# EAGLE schematic nucleum_logger (EAGLE 6.6.0)
AUTHOR: Joshua Adkins; REV: REV_A; TITLE: Nucleum Logger
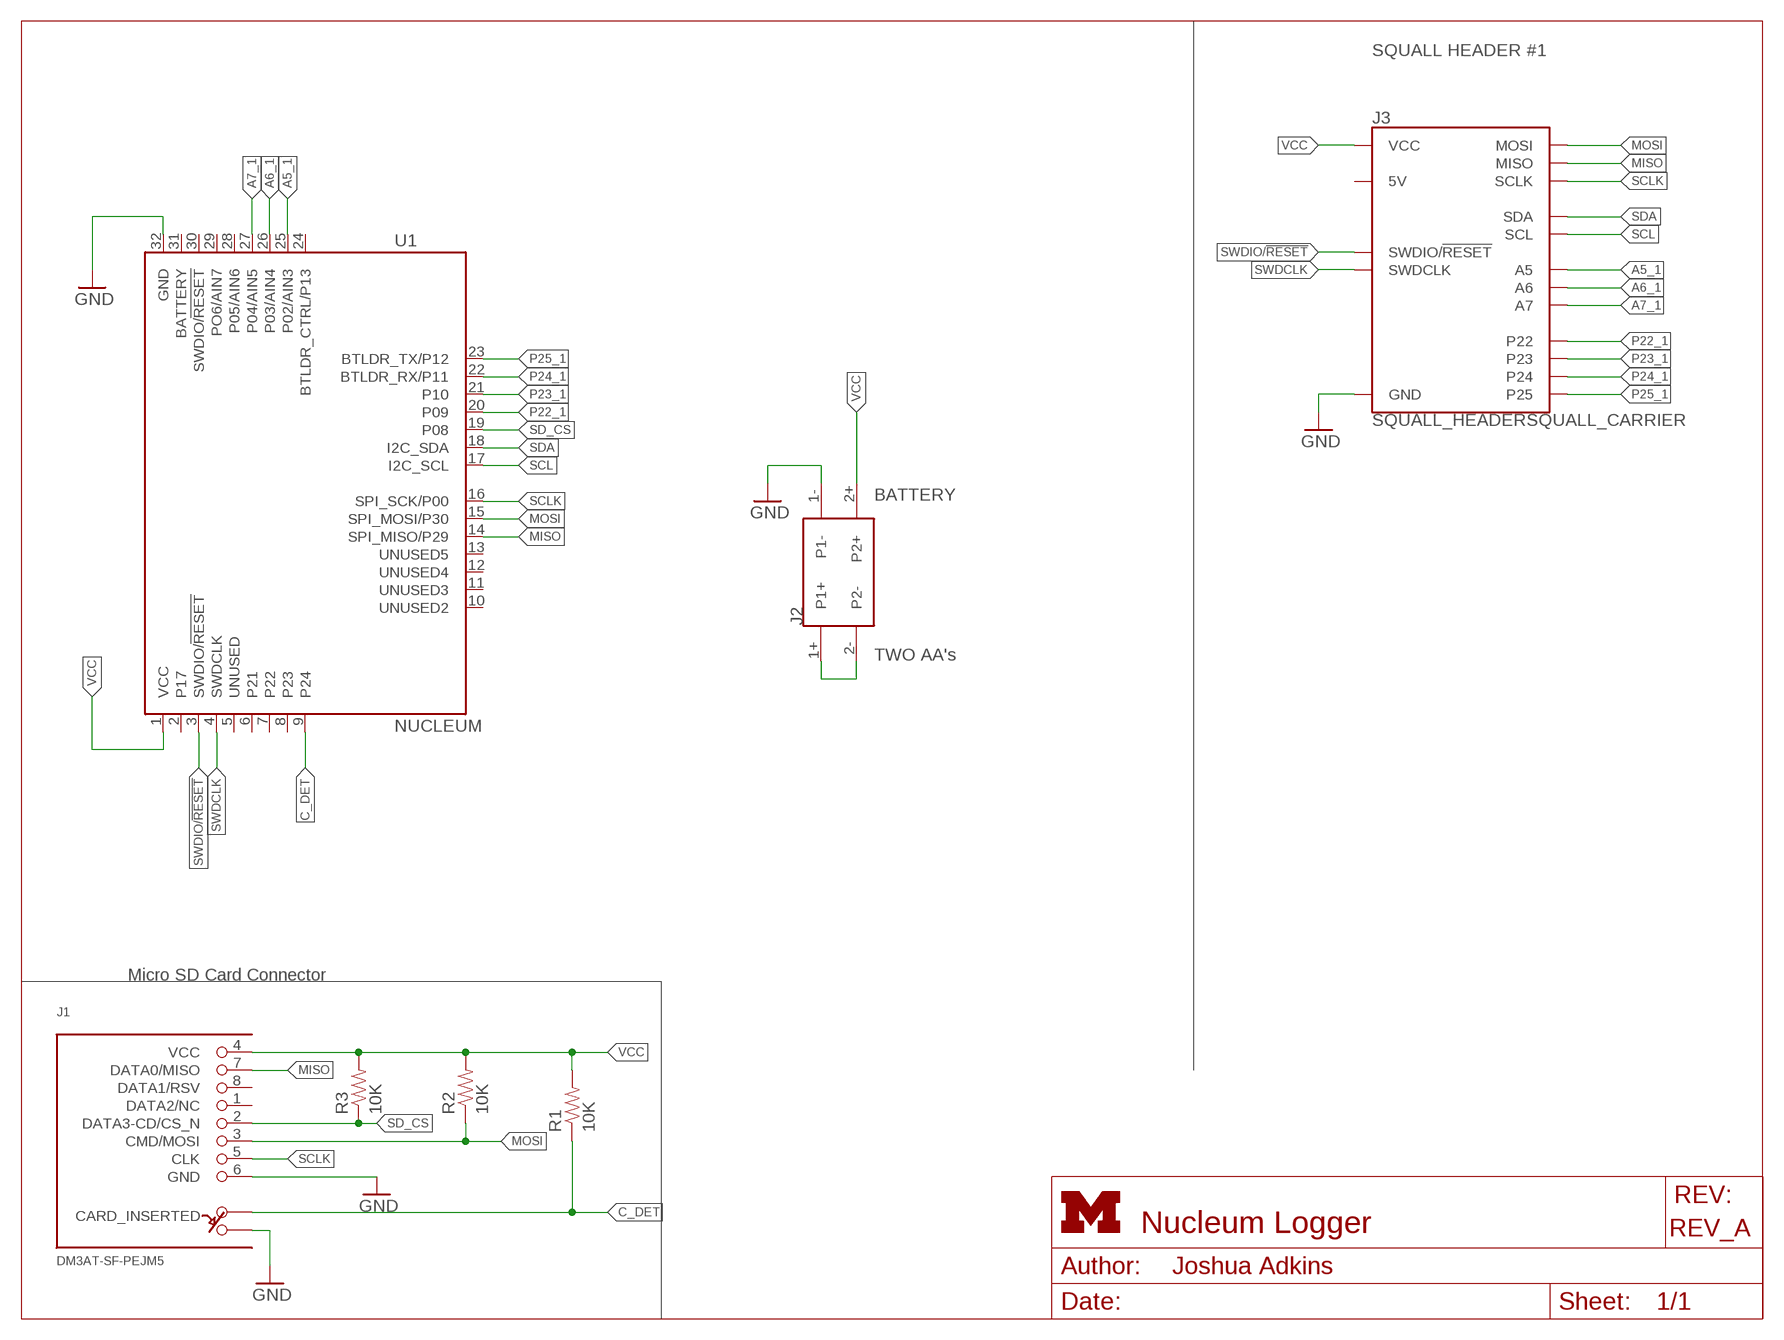
[diagram p0: schematic, sheet 1]
FRAME1 (LETTER_L): HEIGHT: 8.5in; WIDTH: 11in

## Parts
J1  DM3AT-SF-PEJM5  [DM3AT-SF-PEJM5]
J2  AA_BAT_PACKSMD  [AA_SMD]
J3  SQUALL_HEADERSQUALL_CARRIER  [SQUALL_CARRIER]
R1  10K  RESISTOR0402_RES  [0402_RES]
R2  10K  RESISTOR0402_RES  [0402_RES]
R3  10K  RESISTOR0402_RES  [0402_RES]
U1  NUCLEUM  [NUCLEUM]

## Nets
A5_1: J3.B9(A5) U1.25(P02/AIN3)
A6_1: J3.B7(A6) U1.26(P03/AIN4)
A7_1: J3.B5(A7) U1.27(P04/AIN5)
C_DET: J1.A R1.1 U1.9(P24)
GND: J1.6(GND) J1.B J2.1- J3.A9(GND) J3.A10(GND) U1.32(GND)
MISO: J1.7(DATA0/MISO) J3.B8(MISO) U1.14(SPI_MISO/P29)
MOSI: J1.3(CMD/MOSI) J3.B6(MOSI) R2.1 U1.15(SPI_MOSI/P30)
N$1: J2.1+ J2.2-
P22_1: J3.A2(P22) U1.20(P09)
P23_1: J3.A4(P23) U1.21(P10)
P24_1: J3.A6(P24) U1.22(BTLDR_RX/P11)
P25_1: J3.A8(P25) U1.23(BTLDR_TX/P12)
SCL: J3.B3(SCL) U1.17(I2C_SCL)
SCLK: J1.5(CLK) J3.B10(SCLK) U1.16(SPI_SCK/P00)
SD_CS: J1.2(DATA3-CD/CS_N) R3.1 U1.19(P08)
SDA: J3.B1(SDA) U1.18(I2C_SDA)
SWDCLK: J3.B2(SWDCLK) U1.4(SWDCLK)
SWDIO/!RESET: J3.B4(SWDIO/!RESET) U1.3(SWDIO/!RESET)
VCC: J1.4(VCC) J2.2+ J3.A1(VCC) J3.A3(VCC) R1.2 R2.2 R3.2 U1.1(VCC)
Unconnected: J1.1(DATA2/NC) J1.8(DATA1/RSV) J3.A5(5V) J3.A7(5V) U1.2(P17) U1.5(UNUSED) U1.6(P21) U1.7(P22) U1.8(P23) U1.10(UNUSED2) U1.11(UNUSED3) U1.12(UNUSED4) U1.13(UNUSED5) U1.24(BTLDR_CTRL/P13) U1.28(P05/AIN6) U1.29(PO6/AIN7) U1.30(SWDIO/!RESET) U1.31(BATTERY)

## Notes on the sheet
- SQUALL HEADER #1
- BATTERY
- TWO AA's
- Micro SD Card Connector

## Library data of the parts
J1 = connector:DM3AT-SF-PEJM5: CONN MICRO SD R/A PUSH-PUSH SMD; DIGIKEY: HR1964CT-ND
J2 = connector:AA_BAT_PACK: Types of AA Battery Packs
J3 = squall:SQUALL_HEADER: Header for a sensor board on top of the Squall BLE tag board. Requires two DF40C-10DS-0.4V(51).
R1-R3 = passives:RESISTOR: Resistor Basic schematic elements and footprints for 0603, 1206, and PTH resistors.
U1 = nucleum:NUCLEUM: Nucleum sensorboard prototyping module.